# Altium schematic sheet 5_IO_EXTERNOS.SchDoc
size Tabloid; SheetNumber: 4; SheetTotal: 4; SPICEModelCacheXJOKVXOX: <root> / <DocumentId>XJOKVXOX</DocumentId> / </root>
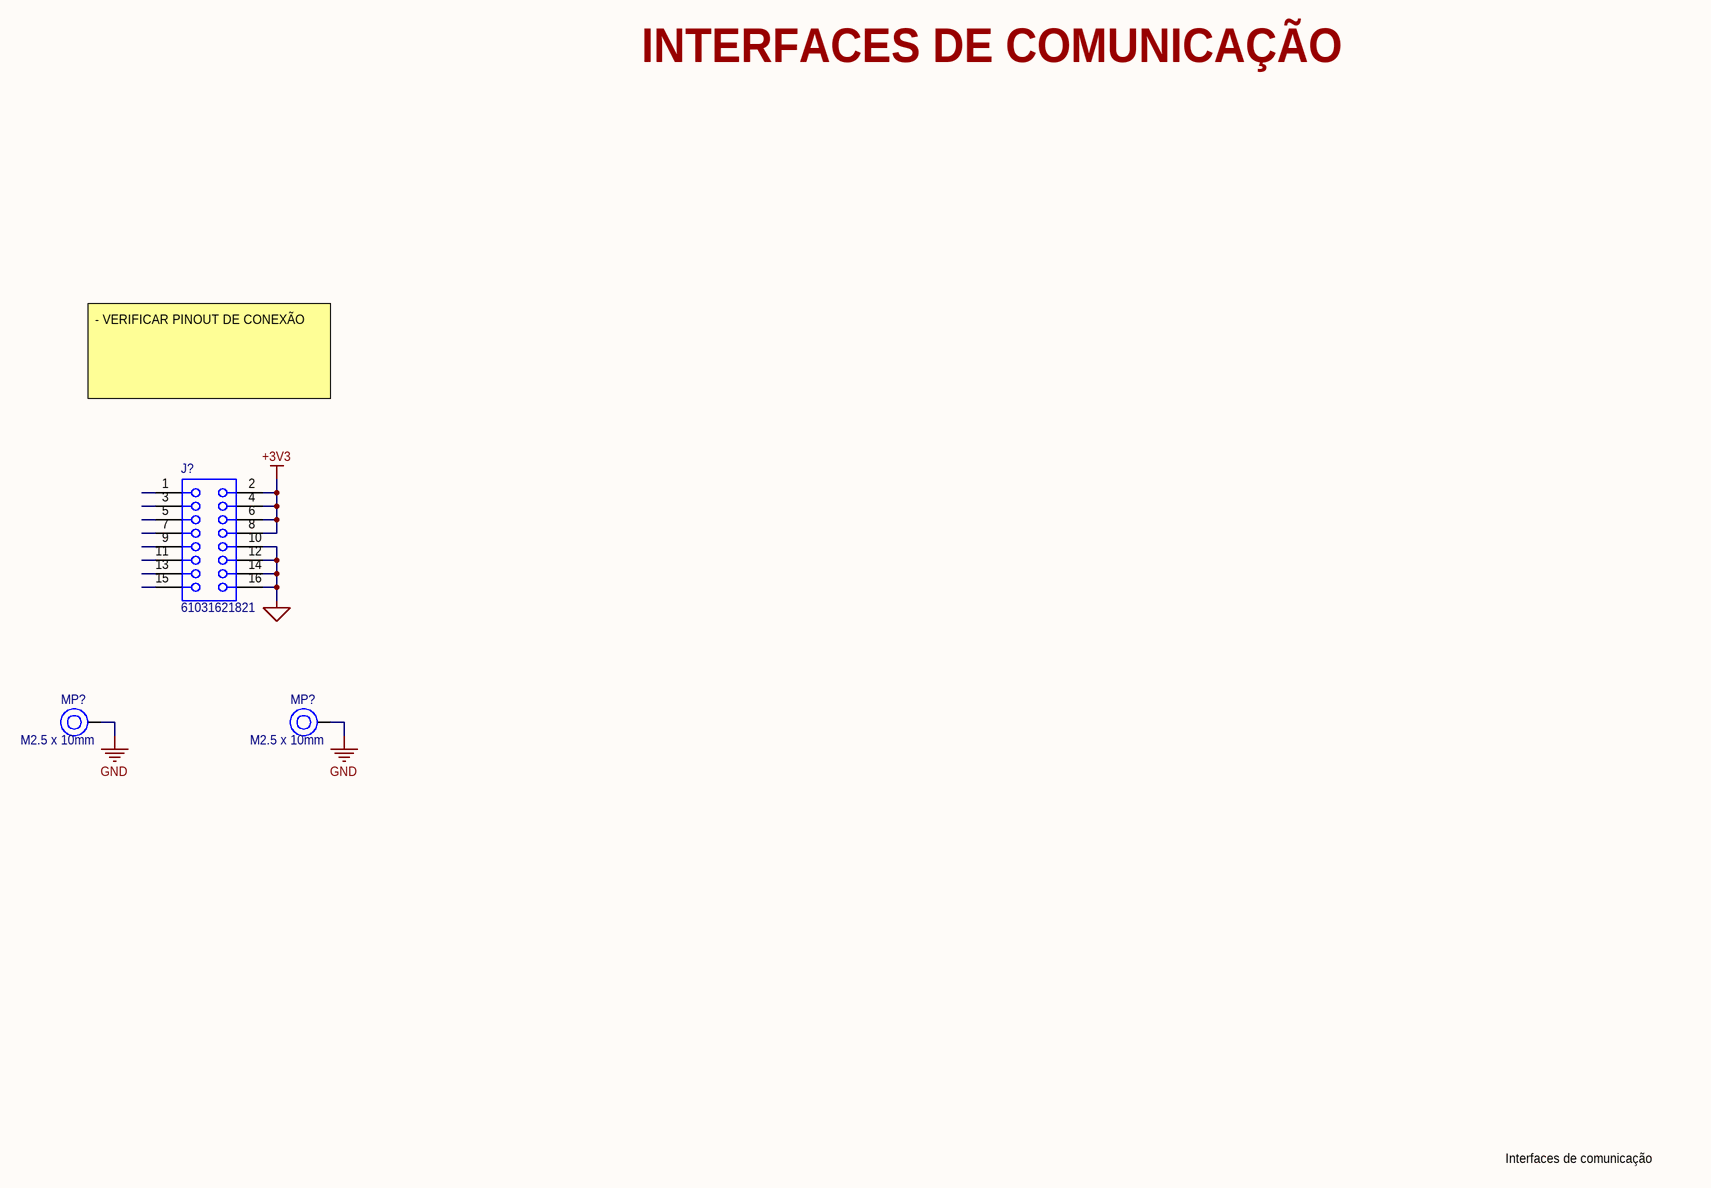
[diagram p0: 5_IO_EXTERNOS.SchDoc]

## Parts
(Parts that share a designator on the sheet are numbered #1, #2 ... from top to bottom, then left to right.)
J?  61031621821  [61031621821]
MP?#1  M2.5 x 10mm  [9774100151]
MP?#2  M2.5 x 10mm  [9774100151]

## Nets
+3V3: J?.2 J?.4 J?.6 J?.8
GND: MP?#1.1 MP?#2.1
GND_ISO: J?.10 J?.12 J?.14 J?.16

Not connected (* = marked no-connect by the designer): J? 1 3 5 7 9 11 13 15

## Notes on the sheet
- INTERFACES DE COMUNICAÇÃO
- - VERIFICAR PINOUT DE CONEXÃO
- Interfaces de comunicação
- Title:
- Size:
- Tabloid
- Number:
- Sheet of:
- Revision:
- Date:
- Project Name:
- Drawn By:

## Library data of the parts
J? = 61031621821: WR-PHD Socket Header, SMT, Vertical, pitch 2.54mm, 2 Row, 16P; Manufacturer: Wurth Elektronik; Contact Resistance: 20mOhm; Rated Current: 3A; Working Voltage: 250V; Withstanding Voltage: 600V; Manufacturer Part Number: 61031621821; Category: Board-to-Board Connectors; Match Code: WR-PHD; ComponentLink1Description: Website Link; ComponentLink1URL: https://www.we-online.com/redexpert/article/61031621821?ad; ComponentLink2Description: Datasheet Link; ComponentLink2URL: https://www.we-online.com/redexpert/spec/61031621821?ad; Mount: Surface Mount; Operating Temperature Min: -40degC; Operating Temperature Max: 105degC; Packaging: Tape and Reel; Gender: Socket Header; Number of Pins: 16; Number of Rows: 2; Orientation: Vertical; Lead Pitch: 2.54mm
MP?#1 MP?#2 = 9774100151R: WA-SMSI SMT Steel Spacer with internal Thread, OD 5.1mm, M2.5 x 10mm; Manufacturer: Wurth Elektronik; Inside Diameter: 3.5mm; Surface: Tin; Manufacturer Part Number: 9774100151R; Category: SMT Spacers; Match Code: WA-SMSI; ComponentLink1Description: Website Link; ComponentLink1URL: https://www.we-online.com/redexpert/article/9774100151R?ad; ComponentLink2Description: Datasheet Link; ComponentLink2URL: https://www.we-online.com/redexpert/spec/9774100151R?ad; Mount: Surface Mount; Operating Temperature Min: -55degC; Operating Temperature Max: 150degC; Packaging: Tape and Reel; Height: 10mm; Material: Steel; Outside Diameter: 5.1mm; Thread Size: M2.5